# Altium schematic sheet Stepper Driver.SchDoc
size A; SheetNumber: 9; SheetTotal: 19
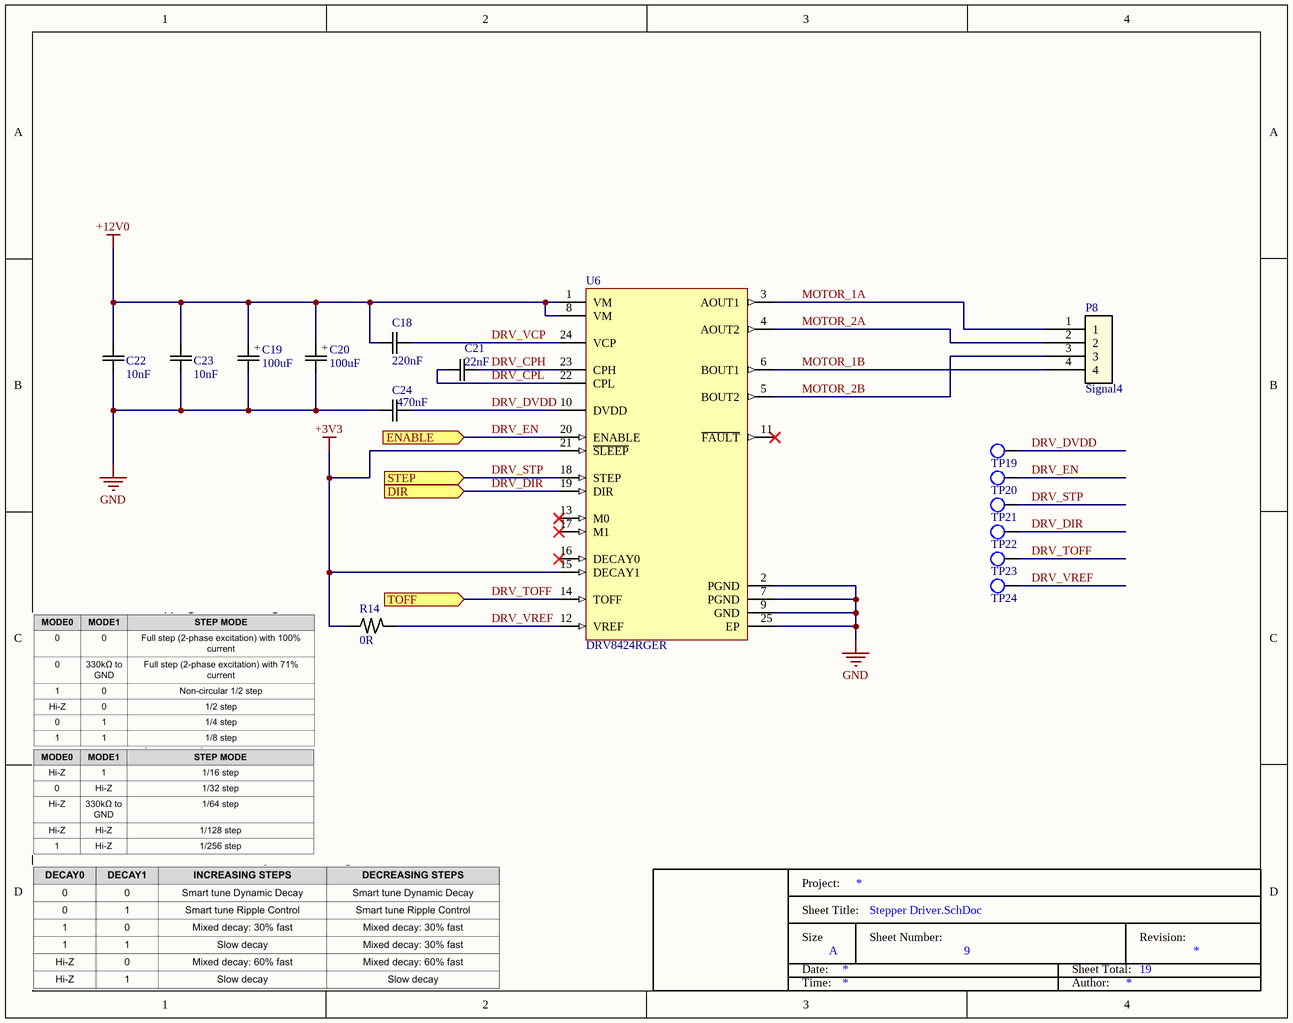
[diagram p0: Stepper Driver.SchDoc]

## Parts
C18  220nF  [C0603]
C19  100uF  [CAP THT D6.3mm]
C20  100uF  [CAP THT D6.3mm]
C21  22nF  [C0603]
C22  10nF  [C0603]
C23  10nF  [C0603]
C24  470nF  [C0603]
P8  Signal4  [Signal4]
R14  0R  [R0603]
TP19  TestPoint  [TESTPOINT_SMD_1.27MM]  (value not drawn)  (no BOM)
TP20  TestPoint  [TESTPOINT_SMD_1.27MM]  (value not drawn)  (no BOM)
TP21  TestPoint  [TESTPOINT_SMD_1.27MM]  (value not drawn)  (no BOM)
TP22  TestPoint  [TESTPOINT_SMD_1.27MM]  (value not drawn)  (no BOM)
TP23  TestPoint  [TESTPOINT_SMD_1.27MM]  (value not drawn)  (no BOM)
TP24  TestPoint  [TESTPOINT_SMD_1.27MM]  (value not drawn)  (no BOM)
U6  DRV8424RGER  [DRV8425RGER]

## Ports
DIR (in), ENABLE (in), STEP (in), TOFF (in)

## Nets
+3V3: R14.1 U6.15(DECAY1) U6.21(~{SLEEP})
+12V0: C18.1 C19.1(+) C20.1(+) C22.1 C23.1 U6.1(VM) U6.8(VM)
GND: C19.2(-) C20.2(-) C22.2 C23.2 C24.1 U6.2(PGND) U6.7(PGND) U6.9(GND) U6.25(EP)
DRV_CPH: C21.2 U6.23(CPH)
DRV_CPL: C21.1 U6.22(CPL)
DRV_DIR: TP22.1 U6.19(DIR) ; port DIR
DRV_DVDD: C24.2 TP19.1 U6.10(DVDD)
DRV_EN: TP20.1 U6.20(ENABLE) ; port ENABLE
DRV_STP: TP21.1 U6.18(STEP) ; port STEP
DRV_TOFF: TP23.1 U6.14(TOFF) ; port TOFF
DRV_VCP: C18.2 U6.24(VCP)
DRV_VREF: R14.2 TP24.1 U6.12(VREF)
MOTOR_1A: P8.1 U6.3(AOUT1)
MOTOR_1B: P8.4 U6.6(BOUT1)
MOTOR_2A: P8.2 U6.4(AOUT2)
MOTOR_2B: P8.3 U6.5(BOUT2)

Not connected (* = marked no-connect by the designer): U6 11(~{FAULT})* 13(M0)* 16(DECAY0)* 17(M1)*

## Notes on the sheet
- Project:
- Sheet Title:
- Size
- Date:
- A
- Sheet Number:
- Sheet Total:
- Revision:
- Time:
- Author:

## Library data of the parts
C18 = Cap_cer: CAP CER 220nF 50V X7R 0603; MF: HRE; MP: CGA0603X7R224K500JT; ComponentLink1Description: Datasheet; ComponentLink1URL: https://www.lcsc.com/datasheet/C6119835.pdf; ComponentLink2Description: Supplier1; ComponentLink2URL: https://www.lcsc.com/product-detail/C6119835.html
C19 C20 = Cap_alu: CAP ALUM 100uF ±20% 16V TH; MF: Lelon; MP: SSG101M1CBK-0605; ComponentLink1Description: Datasheet; ComponentLink1URL: https://www.lcsc.com/datasheet/C311658.pdf; ComponentLink2Description: Supplier1; ComponentLink2URL: https://www.lcsc.com/product-detail/C311658.html
C21 = Cap_cer: CAP CER 22nF 50V X7R 0603; MF: CCTC; MP: TCC0603X7R223M500CT; ComponentLink1Description: Datasheet; ComponentLink1URL: https://www.lcsc.com/datasheet/C696861.pdf; ComponentLink2Description: Supplier1; ComponentLink2URL: https://www.lcsc.com/product-detail/C696861.html
C22 C23 = Cap_cer: CAP CER 10nF 50V X7R 0603; MF: HRE; MP: CGA0603X7R103M500JT; ComponentLink1Description: Datasheet; ComponentLink1URL: https://www.lcsc.com/datasheet/C36911427.pdf; ComponentLink2Description: Supplier1; ComponentLink2URL: https://www.lcsc.com/product-detail/C36911427.html
C24 = Cap_cer: CAP CER 470nF 50V X7R 0603; MF: Chinocera; MP: HGC0603R7474K500NTHJ; ComponentLink1Description: Datasheet; ComponentLink1URL: https://www.lcsc.com/datasheet/C33546006.pdf; ComponentLink2Description: Supplier1; ComponentLink2URL: https://www.lcsc.com/product-detail/C33546006.html
P8 = Signal4: SignalConnector, 4 leads; MF: Molex; MP: 0022232041; ComponentLink1Description: Datasheet; ComponentLink1URL: https://tools.molex.com/pdm_docs/ps/PS-10-07-001.pdf; ComponentLink2Description: Supplier1; ComponentLink2URL: https://www.digikey.com/en/products/detail/molex/0022232041/26671
R14 = Res: RES 0Ω ±5% 100mW 0603; MF: VO; MP: SCR0603J0R; ComponentLink1Description: Datasheet; ComponentLink1URL: https://www.lcsc.com/datasheet/C3017805.pdf; ComponentLink2Description: Supplier1; ComponentLink2URL: https://www.lcsc.com/product-detail/C3017805.html
U6 = DRV8424RGER: Stepper Drivers With Integrated Current Sense, 1/256 Microstepping, STEP/DIR Interface and smart tune Technology; MF: Texas Instruments; ComponentLink1Description: Datasheet; ComponentLink1URL: https://www.lcsc.com/datasheet/C1518725.pdf; ComponentLink2Description: Supplier1; ComponentLink2URL: https://www.lcsc.com/product-detail/C1518725.html?s_z=n_DRV8424RGER; MP: DRV8424RGER